# Altium project nuc972.PrjPcb
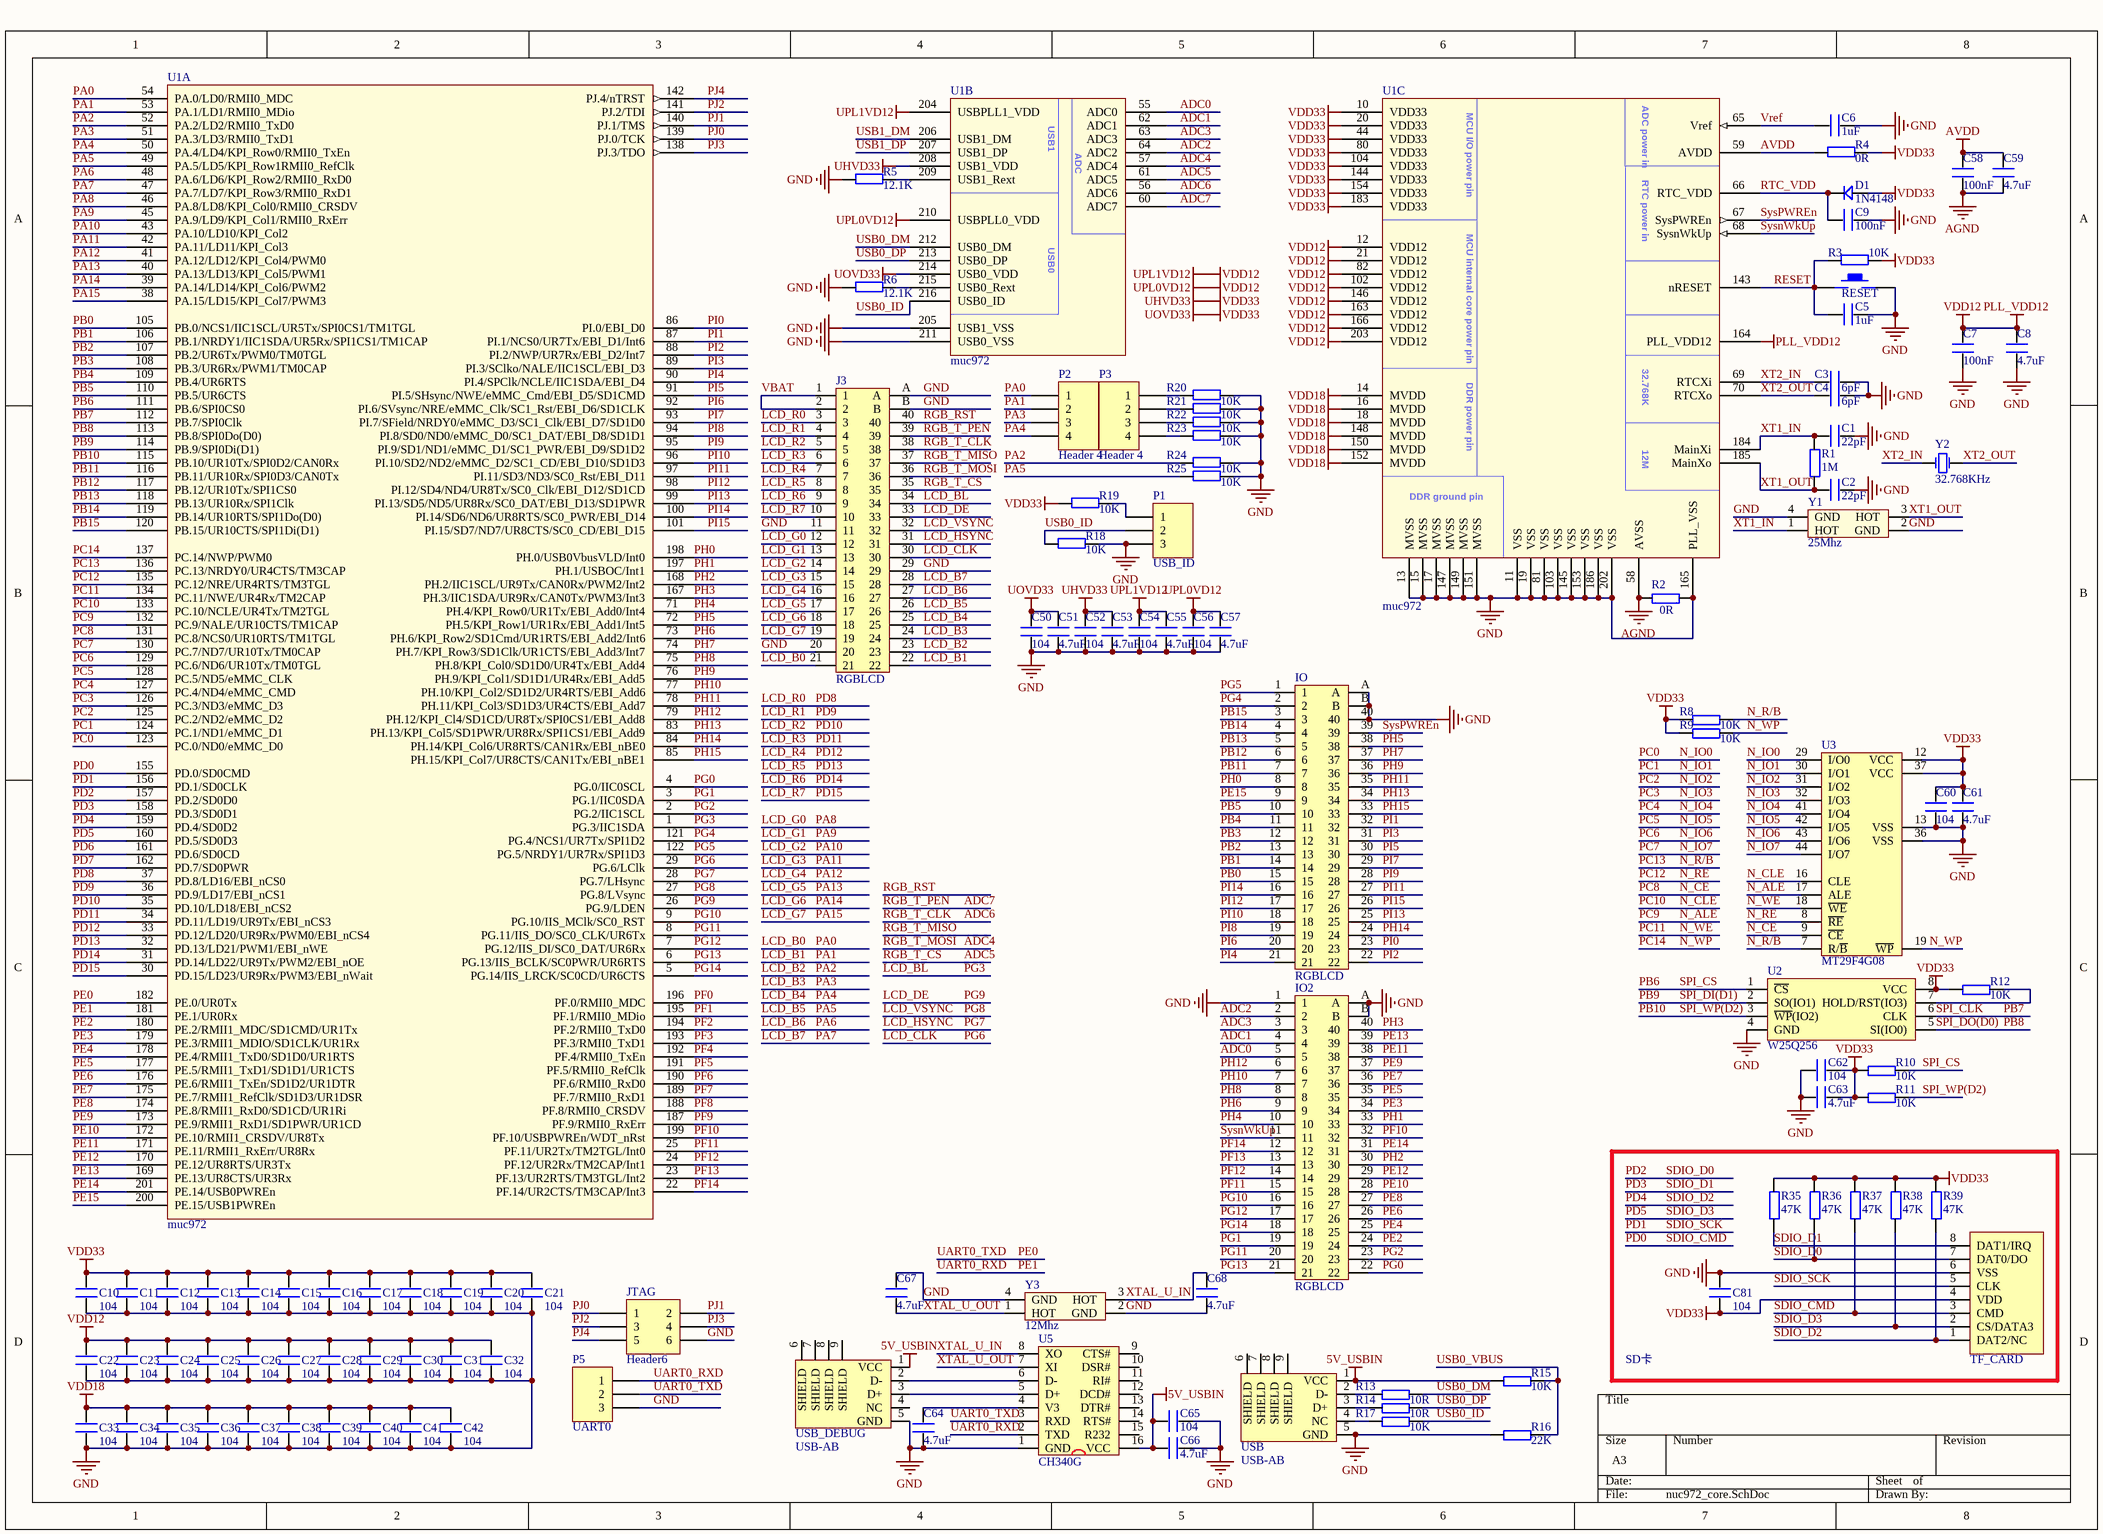
[diagram p0: nuc972_core.SchDoc]
2 sheets, 169 parts. Net scope: global (net labels, ports and power ports of the same name join across sheets).
Board file: nuc972.PcbDoc
Sheets:
  nuc972_core.SchDoc
  nuc972_power.SchDoc

## Sheet nuc972_core.SchDoc
size A3

### Parts
C1  22pF  [C 0603_L]
C2  22pF  [C 0603_L]
C3  6pF  [C 0603_L]
C4  6pF  [C 0603_L]
C5  1uF  [C 0603_L]
C6  1uF  [C 0603_L]
C7  100nF  [C 0603_L]
C8  4.7uF  [C 0603_L]
C9  100nF  [C 0603_L]
C10  104  [C 0603_L]
C11  104  [C 0603_L]
C12  104  [C 0603_L]
C13  104  [C 0603_L]
C14  104  [C 0603_L]
C15  104  [C 0603_L]
C16  104  [C 0603_L]
C17  104  [C 0603_L]
C18  104  [C 0603_L]
C19  104  [C 0603_L]
C20  104  [C 0603_L]
C21  104  [C 0603_L]
C22  104  [C 0603_L]
C23  104  [C 0603_L]
C24  104  [C 0603_L]
C25  104  [C 0603_L]
C26  104  [C 0603_L]
C27  104  [C 0603_L]
C28  104  [C 0603_L]
C29  104  [C 0603_L]
C30  104  [C 0603_L]
C31  104  [C 0603_L]
C32  104  [C 0603_L]
C33  104  [C 0603_L]
C34  104  [C 0603_L]
C35  104  [C 0603_L]
C36  104  [C 0603_L]
C37  104  [C 0603_L]
C38  104  [C 0603_L]
C39  104  [C 0603_L]
C40  104  [C 0603_L]
C41  104  [C 0603_L]
C42  104  [C 0603_L]
C50  104  [C 0603_L]
C51  4.7uF  [C 0603_L]
C52  104  [C 0603_L]
C53  4.7uF  [C 0603_L]
C54  104  [C 0603_L]
C55  4.7uF  [C 0603_L]
C56  104  [C 0603_L]
C57  4.7uF  [C 0603_L]
C58  100nF  [C 0603_L]
C59  4.7uF  [C 0603_L]
C60  104  [C 0603_L]
C61  4.7uF  [C 0603_L]
C62  104  [C 0603_L]
C63  4.7uF  [C 0603_L]
C64  4.7uF  [C 0603_L]
C65  104  [C 0603_L]
C66  4.7uF  [C 0603_L]
C67  4.7uF  [C 0603_L]
C68  4.7uF  [C 0603_L]
C81  104  [C 0603_L]
D1  1N4148  [MINI_MELF (LL34)]
IO  RGBLCD  [FPC-TOP40]
IO2  RGBLCD  [FPC-TOP40]
J3  RGBLCD  [FPC-TOP40]
JTAG  Header6  [HDR2.54-LI-6P]
P1  USB_ID  [HDR2.54-LI-3P]
P2  Header 4  [HDR2.54-LI-4P]
P3  Header 4  [HDR2.54-LI-4P]
P5  UART0  [HDR2.54-LI-3P]
R1  1M  [R 0603_L]
R2  0R  [R 0603_L]
R3  10K  [R 0603_L]
R4  0R  [R 0603_L]
R5  12.1K  [R 0603_L]
R6  12.1K  [R 0603_L]
R8  10K  [R 0603_L]
R9  10K  [R 0603_L]
R10  10K  [R 0603_L]
R11  10K  [R 0603_L]
R12  10K  [R 0603_L]
R13  10R  [R 0603_L]
R14  10R  [R 0603_L]
R15  10K  [R 0603_L]
R16  22K  [R 0603_L]
R17  10K  [R 0603_L]
R18  10K  [R 0603_L]
R19  10K  [R 0603_L]
R20  10K  [R 0603_L]
R21  10K  [R 0603_L]
R22  10K  [R 0603_L]
R23  10K  [R 0603_L]
R24  10K  [R 0603_L]
R25  10K  [R 0603_L]
R35  47K  [R 0603_L]
R36  47K  [R 0603_L]
R37  47K  [R 0603_L]
R38  47K  [R 0603_L]
R39  47K  [R 0603_L]
RESET  KEY_M  [TSW DIP-6*6*5]  (value not drawn)
TF_CARD  SD-MICRO-TF  [SD-MICRO-TF]  (value not drawn)
U1  muc972  [LQFP_216]  (parts A,B,C of 3)
U2  W25Q256  [SOP8W_N]
U3  MT29F4G08  [TSOP48]
U5  CH340G  [SOP16_N]
USB  USB-AB  [USB-MICRO_B]
USB_DEBUG  USB-AB  [USB-MICRO_B]
Y1  25Mhz  [OSC 3225-4P]
Y2  32.768KHz  [OSC 3215-2P]
Y3  12Mhz  [OSC 3225-4P]

### Blocks framed on the sheet
SD卡: C81 R35-R39 TF_CARD

### Nets
5V_USBIN: C65.1 C66.1 R15.1 U5.16(VCC) USB.1(VCC) USB_DEBUG.1(VCC)
AGND: C58.1 C59.1 R2.1 U1.58(AVSS)
AVDD: C58.2 C59.2 R4.2 U1.59(AVDD)
GND: C1.1 C2.1 C3.1 C4.1 C5.2 C6.2 C7.1 C8.1 C9.1 C10.1 C11.1 C12.1 C13.1 C14.1 C15.1 C16.1 C17.1 C18.1 C19.1 C20.1 C21.1 C22.1 C23.1 C24.1 C25.1 C26.1 C27.1 C28.1 C29.1 C30.1 C31.1 C32.1 C33.1 C34.1 C35.1 C36.1 C37.1 C38.1 C39.1 C40.1 C41.1 C42.1 C50.1 C51.1 C52.1 C53.1 C54.1 C55.1 C56.1 C57.1 C60.1 C61.1 C62.2 C63.2 C64.2 C65.2 C66.2 C67.2 C68.1 C81.2 IO.40 IO.A IO.B IO2.1 IO2.A IO2.B J3.11 J3.20 J3.29 J3.A J3.B JTAG.6 P1.3 P5.3 R2.2 R5.2 R6.2 R16.1 R18.1 R20.1 R21.1 R22.1 R23.1 R24.1 R25.1 RESET.2 TF_CARD.6(VSS) U1.11(VSS) U1.13(MVSS) U1.15(MVSS) U1.17(MVSS) U1.19(VSS) U1.81(VSS) U1.103(VSS) U1.145(VSS) U1.147(MVSS) U1.149(MVSS) U1.151(MVSS) U1.153(VSS) U1.165(PLL_VSS) U1.186(VSS) U1.202(VSS) U1.205(USB1_VSS) U1.211(USB0_VSS) U2.4(GND) U3.13(VSS) U3.36(VSS) U5.1(GND) USB.5(GND) USB_DEBUG.5(GND) Y1.2(GND) Y1.4(GND) Y3.2(GND) Y3.4(GND)
PLL_VDD12: C7.2 C8.2 C22.2 C23.2 C24.2 C25.2 C26.2 C27.2 C28.2 C29.2 C30.2 C31.2 C32.2 C54.2 C55.2 C56.2 C57.2 U1.12(VDD12) U1.21(VDD12) U1.82(VDD12) U1.102(VDD12) U1.146(VDD12) U1.163(VDD12) U1.164(PLL_VDD12) U1.166(VDD12) U1.203(VDD12) U1.204(USBPLL1_VDD) U1.210(USBPLL0_VDD)  [also labelled UPL0VD12, UPL1VD12, VDD12]
UHVD33: C10.2 C11.2 C12.2 C13.2 C14.2 C15.2 C16.2 C17.2 C18.2 C19.2 C20.2 C21.2 C50.2 C51.2 C52.2 C53.2 C60.2 C61.2 C62.1 C63.1 C81.1 D1.1 R3.1 R4.1 R8.1 R9.1 R10.1 R11.1 R12.1 R19.2 R35.2 R36.2 R37.2 R38.2 R39.2 TF_CARD.4(VDD) U1.10(VDD33) U1.20(VDD33) U1.44(VDD33) U1.80(VDD33) U1.104(VDD33) U1.144(VDD33) U1.154(VDD33) U1.183(VDD33) U1.208(USB1_VDD) U1.214(USB0_VDD) U2.8(VCC) U3.12(VCC) U3.37(VCC)  [also labelled UOVD33, VDD33]
VBAT: J3.1 J3.2
VDD18: C33.2 C34.2 C35.2 C36.2 C37.2 C38.2 C39.2 C40.2 C41.2 C42.2 U1.14(MVDD) U1.16(MVDD) U1.18(MVDD) U1.148(MVDD) U1.150(MVDD) U1.152(MVDD)
ADC0: IO2.5 U1.55(ADC0)
ADC1: IO2.4 U1.62(ADC1)
ADC2: IO2.2 U1.64(ADC2)
ADC3: IO2.3 U1.63(ADC3)
ADC4: J3.36 U1.57(ADC4)  [also labelled RGB_T_MOSI]
ADC5: J3.35 U1.61(ADC5)  [also labelled RGB_T_CS]
ADC6: J3.38 U1.56(ADC6)  [also labelled RGB_T_CLK]
ADC7: J3.39 U1.60(ADC7)  [also labelled RGB_T_PEN]
LCD_B0: J3.21 P2.1 U1.54(PA.0/LD0/RMII0_MDC)  [also labelled PA0]
LCD_B1: J3.22 P2.2 U1.53(PA.1/LD1/RMII0_MDio)  [also labelled PA1]
LCD_B2: J3.23 R24.2 U1.52(PA.2/LD2/RMII0_TxD0)  [also labelled PA2]
LCD_B3: J3.24 P2.3 U1.51(PA.3/LD3/RMII0_TxD1)  [also labelled PA3]
LCD_B4: J3.25 P2.4 U1.50(PA.4/LD4/KPI_Row0/RMII0_TxEn)  [also labelled PA4]
LCD_B5: J3.26 R25.2 U1.49(PA.5/LD5/KPI_Row1RMII0_RefClk)  [also labelled PA5]
LCD_B6: J3.27 U1.48(PA.6/LD6/KPI_Row2/RMII0_RxD0)  [also labelled PA6]
LCD_B7: J3.28 U1.47(PA.7/LD7/KPI_Row3/RMII0_RxD1)  [also labelled PA7]
LCD_BL: J3.34 U1.1(PG.3/IIC1SDA)  [also labelled PG3]
LCD_CLK: J3.30 U1.29(PG.6/LClk)  [also labelled PG6]
LCD_DE: J3.33 U1.26(PG.9/LDEN)  [also labelled PG9]
LCD_G0: J3.12 U1.46(PA.8/LD8/KPI_Col0/RMII0_CRSDV)  [also labelled PA8]
LCD_G1: J3.13 U1.45(PA.9/LD9/KPI_Col1/RMII0_RxErr)  [also labelled PA9]
LCD_G2: J3.14 U1.43(PA.10/LD10/KPI_Col2)  [also labelled PA10]
LCD_G3: J3.15 U1.42(PA.11/LD11/KPI_Col3)  [also labelled PA11]
LCD_G4: J3.16 U1.41(PA.12/LD12/KPI_Col4/PWM0)  [also labelled PA12]
LCD_G5: J3.17 U1.40(PA.13/LD13/KPI_Col5/PWM1)  [also labelled PA13]
LCD_G6: J3.18 U1.39(PA.14/LD14/KPI_Col6/PWM2)  [also labelled PA14]
LCD_G7: J3.19 U1.38(PA.15/LD15/KPI_Col7/PWM3)  [also labelled PA15]
LCD_HSYNC: J3.31 U1.28(PG.7/LHsync)  [also labelled PG7]
LCD_R0: J3.3 U1.37(PD.8/LD16/EBI_nCS0)  [also labelled PD8]
LCD_R1: J3.4 U1.36(PD.9/LD17/EBI_nCS1)  [also labelled PD9]
LCD_R2: J3.5 U1.35(PD.10/LD18/EBI_nCS2)  [also labelled PD10]
LCD_R3: J3.6 U1.34(PD.11/LD19/UR9Tx/EBI_nCS3)  [also labelled PD11]
LCD_R4: J3.7 U1.33(PD.12/LD20/UR9Rx/PWM0/EBI_nCS4)  [also labelled PD12]
LCD_R5: J3.8 U1.32(PD.13/LD21/PWM1/EBI_nWE)  [also labelled PD13]
LCD_R6: J3.9 U1.31(PD.14/LD22/UR9Tx/PWM2/EBI_nOE)  [also labelled PD14]
LCD_R7: J3.10 U1.30(PD.15/LD23/UR9Rx/PWM3/EBI_nWait)  [also labelled PD15]
LCD_VSYNC: J3.32 U1.27(PG.8/LVsync)  [also labelled PG8]
N_ALE: U1.132(PC.9/NALE/UR10CTS/TM1CAP) U3.17(ALE)  [also labelled PC9]
N_CE: U1.131(PC.8/NCS0/UR10RTS/TM1TGL) U3.9(~{CE})  [also labelled PC8]
N_CLE: U1.133(PC.10/NCLE/UR4Tx/TM2TGL) U3.16(CLE)  [also labelled PC10]
N_IO0: U1.123(PC.0/ND0/eMMC_D0) U3.29(I/O0)  [also labelled PC0]
N_IO1: U1.124(PC.1/ND1/eMMC_D1) U3.30(I/O1)  [also labelled PC1]
N_IO2: U1.125(PC.2/ND2/eMMC_D2) U3.31(I/O2)  [also labelled PC2]
N_IO3: U1.126(PC.3/ND3/eMMC_D3) U3.32(I/O3)  [also labelled PC3]
N_IO4: U1.127(PC.4/ND4/eMMC_CMD) U3.41(I/O4)  [also labelled PC4]
N_IO5: U1.128(PC.5/ND5/eMMC_CLK) U3.42(I/O5)  [also labelled PC5]
N_IO6: U1.129(PC.6/ND6/UR10Tx/TM0TGL) U3.43(I/O6)  [also labelled PC6]
N_IO7: U1.130(PC.7/ND7/UR10Tx/TM0CAP) U3.44(I/O7)  [also labelled PC7]
N_R/B: R8.2 U1.136(PC.13/NRDY0/UR4CTS/TM3CAP) U3.7(R/~{B})  [also labelled PC13]
N_RE: U1.135(PC.12/NRE/UR4RTS/TM3TGL) U3.8(~{RE})  [also labelled PC12]
N_WE: U1.134(PC.11/NWE/UR4Rx/TM2CAP) U3.18(~{WE})  [also labelled PC11]
N_WP: R9.2 U1.137(PC.14/NWP/PWM0) U3.19(~{WP})  [also labelled PC14]
PB0: IO.15 U1.105(PB.0/NCS1/IIC1SCL/UR5Tx/SPI0CS1/TM1TGL)
PB1: IO.14 U1.106(PB.1/NRDY1/IIC1SDA/UR5Rx/SPI1CS1/TM1CAP)
PB2: IO.13 U1.107(PB.2/UR6Tx/PWM0/TM0TGL)
PB3: IO.12 U1.108(PB.3/UR6Rx/PWM1/TM0CAP)
PB4: IO.11 U1.109(PB.4/UR6RTS)
PB5: IO.10 U1.110(PB.5/UR6CTS)
PB6: R10.2 U1.111(PB.6/SPI0CS0) U2.1(~{CS})  [also labelled SPI_CS]
PB7: U1.112(PB.7/SPI0Clk) U2.6(CLK)  [also labelled SPI_CLK]
PB8: U1.113(PB.8/SPI0Do(D0)) U2.5(SI(IO0))  [also labelled SPI_DO(D0)]
PB9: U1.114(PB.9/SPI0Di(D1)) U2.2(SO(IO1))  [also labelled SPI_DI(D1)]
PB10: R11.2 U1.115(PB.10/UR10Tx/SPI0D2/CAN0Rx) U2.3(~{WP}(IO2))  [also labelled SPI_WP(D2)]
PB11: IO.7 U1.116(PB.11/UR10Rx/SPI0D3/CAN0Tx)
PB12: IO.6 U1.117(PB.12/UR10Tx/SPI1CS0)
PB13: IO.5 U1.118(PB.13/UR10Rx/SPI1Clk)
PB14: IO.4 U1.119(PB.14/UR10RTS/SPI1Do(D0))
PB15: IO.3 U1.120(PB.15/UR10CTS/SPI1Di(D1))
PD0: R37.1 TF_CARD.3(CMD) U1.155(PD.0/SD0CMD)  [also labelled SDIO_CMD]
PD1: TF_CARD.5(CLK) U1.156(PD.1/SD0CLK)  [also labelled SDIO_SCK]
PD2: R36.1 TF_CARD.7(DAT0/DO) U1.157(PD.2/SD0D0)  [also labelled SDIO_D0]
PD3: R35.1 TF_CARD.8(DAT1/IRQ) U1.158(PD.3/SD0D1)  [also labelled SDIO_D1]
PD4: R39.1 TF_CARD.1(DAT2/NC) U1.159(PD.4/SD0D2)  [also labelled SDIO_D2]
PD5: R38.1 TF_CARD.2(CS/DATA3) U1.160(PD.5/SD0D3)  [also labelled SDIO_D3]
PD6: U1.161(PD.6/SD0CD)
PD7: U1.162(PD.7/SD0PWR)
PE0: P5.2 U1.182(PE.0/UR0Tx) U5.3(RXD)  [also labelled UART0_TXD]
PE1: P5.1 U1.181(PE.1/UR0Rx) U5.2(TXD)  [also labelled UART0_RXD]
PE2: IO2.24 U1.180(PE.2/RMII1_MDC/SD1CMD/UR1Tx)
PE3: IO2.34 U1.179(PE.3/RMII1_MDIO/SD1CLK/UR1Rx)
PE4: IO2.25 U1.178(PE.4/RMII1_TxD0/SD1D0/UR1RTS)
PE5: IO2.35 U1.177(PE.5/RMII1_TxD1/SD1D1/UR1CTS)
PE6: IO2.26 U1.176(PE.6/RMII1_TxEn/SD1D2/UR1DTR)
PE7: IO2.36 U1.175(PE.7/RMII1_RefClk/SD1D3/UR1DSR)
PE8: IO2.27 U1.174(PE.8/RMII1_RxD0/SD1CD/UR1Ri)
PE9: IO2.37 U1.173(PE.9/RMII1_RxD1/SD1PWR/UR1CD)
PE10: IO2.28 U1.172(PE.10/RMII1_CRSDV/UR8Tx)
PE11: IO2.38 U1.171(PE.11/RMII1_RxErr/UR8Rx)
PE12: IO2.29 U1.170(PE.12/UR8RTS/UR3Tx)
PE13: IO2.39 U1.169(PE.13/UR8CTS/UR3Rx)
PE14: IO2.31 U1.201(PE.14/USB0PWREn)
PE15: IO.9 U1.200(PE.15/USB1PWREn)
PF0: U1.196(PF.0/RMII0_MDC)  [project net ETH_MDC]
PF1: U1.195(PF.1/RMII0_MDio)  [project net ETH_MDIO]
PF2: U1.194(PF.2/RMII0_TxD0)
PF3: U1.193(PF.3/RMII0_TxD1)
PF4: U1.192(PF.4/RMII0_TxEn)
PF5: U1.191(PF.5/RMII0_RefClk)
PF6: U1.190(PF.6/RMII0_RxD0)
PF7: U1.189(PF.7/RMII0_RxD1)
PF8: U1.188(PF.8/RMII0_CRSDV)
PF9: U1.187(PF.9/RMII0_RxErr)
PF10: IO2.32 U1.199(PF.10/USBPWREn/WDT_nRst)
PF11: IO2.15 U1.25(PF.11/UR2Tx/TM2TGL/Int0)
PF12: IO2.14 U1.24(PF.12/UR2Rx/TM2CAP/Int1)
PF13: IO2.13 U1.23(PF.13/UR2RTS/TM3TGL/Int2)
PF14: IO2.12 U1.22(PF.14/UR2CTS/TM3CAP/Int3)
PG0: IO2.22 U1.4(PG.0/IIC0SCL)
PG1: IO2.19 U1.3(PG.1/IIC0SDA)
PG2: IO2.23 U1.2(PG.2/IIC1SCL)
PG4: IO.2 U1.121(PG.4/NCS1/UR7Tx/SPI1D2)
PG5: IO.1 U1.122(PG.5/NRDY1/UR7Rx/SPI1D3)
PG10: IO2.16 U1.9(PG.10/IIS_MClk/SC0_RST)
PG11: IO2.20 U1.8(PG.11/IIS_DO/SC0_CLK/UR6Tx)
PG12: IO2.17 U1.7(PG.12/IIS_DI/SC0_DAT/UR6Rx)
PG13: IO2.21 U1.6(PG.13/IIS_BCLK/SC0PWR/UR6RTS)
PG14: IO2.18 U1.5(PG.14/IIS_LRCK/SC0CD/UR6CTS)
PH0: IO.8 U1.198(PH.0/USB0VbusVLD/Int0)
PH1: IO2.33 U1.197(PH.1/USBOC/Int1)
PH2: IO2.30 U1.168(PH.2/IIC1SCL/UR9Tx/CAN0Rx/PWM2/Int2)
PH3: IO2.40 U1.167(PH.3/IIC1SDA/UR9Rx/CAN0Tx/PWM3/Int3)
PH4: IO2.10 U1.71(PH.4/KPI_Row0/UR1Tx/EBI_Add0/Int4)
PH5: IO.38 U1.72(PH.5/KPI_Row1/UR1Rx/EBI_Add1/Int5)
PH6: IO2.9 U1.73(PH.6/KPI_Row2/SD1Cmd/UR1RTS/EBI_Add2/Int6)
PH7: IO.37 U1.74(PH.7/KPI_Row3/SD1Clk/UR1CTS/EBI_Add3/Int7)
PH8: IO2.8 U1.75(PH.8/KPI_Col0/SD1D0/UR4Tx/EBI_Add4)
PH9: IO.36 U1.76(PH.9/KPI_Col1/SD1D1/UR4Rx/EBI_Add5)
PH10: IO2.7 U1.77(PH.10/KPI_Col2/SD1D2/UR4RTS/EBI_Add6)
PH11: IO.35 U1.78(PH.11/KPI_Col3/SD1D3/UR4CTS/EBI_Add7)
PH12: IO2.6 U1.79(PH.12/KPI_Cl4/SD1CD/UR8Tx/SPI0CS1/EBI_Add8)
PH13: IO.34 U1.83(PH.13/KPI_Col5/SD1PWR/UR8Rx/SPI1CS1/EBI_Add9)
PH14: IO.24 U1.84(PH.14/KPI_Col6/UR8RTS/CAN1Rx/EBI_nBE0)
PH15: IO.33 U1.85(PH.15/KPI_Col7/UR8CTS/CAN1Tx/EBI_nBE1)
PI0: IO.23 U1.86(PI.0/EBI_D0)
PI1: IO.32 U1.87(PI.1/NCS0/UR7Tx/EBI_D1/Int6)
PI2: IO.22 U1.88(PI.2/NWP/UR7Rx/EBI_D2/Int7)
PI3: IO.31 U1.89(PI.3/SClko/NALE/IIC1SCL/EBI_D3)
PI4: IO.21 U1.90(PI.4/SPClk/NCLE/IIC1SDA/EBI_D4)
PI5: IO.30 U1.91(PI.5/SHsync/NWE/eMMC_Cmd/EBI_D5/SD1CMD)
PI6: IO.20 U1.92(PI.6/SVsync/NRE/eMMC_Clk/SC1_Rst/EBI_D6/SD1CLK)
PI7: IO.29 U1.93(PI.7/SField/NRDY0/eMMC_D3/SC1_Clk/EBI_D7/SD1D0)
PI8: IO.19 U1.94(PI.8/SD0/ND0/eMMC_D0/SC1_DAT/EBI_D8/SD1D1)
PI9: IO.28 U1.95(PI.9/SD1/ND1/eMMC_D1/SC1_PWR/EBI_D9/SD1D2)
PI10: IO.18 U1.96(PI.10/SD2/ND2/eMMC_D2/SC1_CD/EBI_D10/SD1D3)
PI11: IO.27 U1.97(PI.11/SD3/ND3/SC0_Rst/EBI_D11)
PI12: IO.17 U1.98(PI.12/SD4/ND4/UR8Tx/SC0_Clk/EBI_D12/SD1CD)
PI13: IO.25 U1.99(PI.13/SD5/ND5/UR8Rx/SC0_DAT/EBI_D13/SD1PWR)
PI14: IO.16 U1.100(PI.14/SD6/ND6/UR8RTS/SC0_PWR/EBI_D14)
PI15: IO.26 U1.101(PI.15/SD7/ND7/UR8CTS/SC0_CD/EBI_D15)
PJ0: JTAG.1 U1.139(PJ.0/TCK)
PJ1: JTAG.2 U1.140(PJ.1/TMS)
PJ2: JTAG.3 U1.141(PJ.2/TDI)
PJ3: JTAG.4 U1.138(PJ.3/TDO)
PJ4: JTAG.5 U1.142(PJ.4/nTRST)
RESET: C5.1 R3.2 RESET.1 U1.143(nRESET)
RGB_RST: J3.40
RGB_T_MISO: J3.37
RTC_VDD: C9.2 D1.2 U1.66(RTC_VDD)
SysnWkUp: IO2.11 U1.68(SysnWkUp)
SysPWREn: IO.39 U1.67(SysPWREn)
USB0_DM: R13.2 U1.212(USB0_DM)
USB0_DP: R14.2 U1.213(USB0_DP)
USB0_ID: P1.2 R17.2 R18.2 U1.216(USB0_ID)
USB0_VBUS: R15.2 R16.2
USB1_DM: U1.206(USB1_DM)
USB1_DP: U1.207(USB1_DP)
Vref: C6.1 U1.65(Vref)
XT1_IN: C1.2 R1.2 U1.184(MainXi) Y1.1(HOT)
XT1_OUT: C2.2 R1.1 U1.185(MainXo) Y1.3(HOT)
XT2_IN: C3.2 U1.69(RTCXi) Y2.1(OSC1)
XT2_OUT: C4.2 U1.70(RTCXo) Y2.2(OSC2)
XTAL_U_IN: C68.2 U5.8(XO) Y3.3(HOT)
XTAL_U_OUT: C67.1 U5.7(XI) Y3.1(HOT)
NetC64_1: C64.1 U5.4(V3)
NetP1_1: P1.1 R19.1
NetP3_1: P3.1 R20.2
NetP3_2: P3.2 R21.2
NetP3_3: P3.3 R22.2
NetP3_4: P3.4 R23.2
NetR5_1: R5.1 U1.209(USB1_Rext)
NetR6_1: R6.1 U1.215(USB0_Rext)
NetR12_2: R12.2 U2.7(HOLD/RST(IO3))
NetR13_1: R13.1 USB.2(D-)
NetR14_1: R14.1 USB.3(D+)
NetR17_1: R17.1 USB.4(NC)
NetU5_5: U5.5(D+) USB_DEBUG.3(D+)
NetU5_6: U5.6(D-) USB_DEBUG.2(D-)

Not connected (* = marked no-connect by the designer): U5 9(CTS#) 10(DSR#) 11(RI#) 12(DCD#) 13(DTR#) 14(RTS#) 15(R232); USB 6(SHIELD) 7(SHIELD) 8(SHIELD) 9(SHIELD); USB_DEBUG 4(NC) 6(SHIELD) 7(SHIELD) 8(SHIELD) 9(SHIELD)

### Notes on the sheet
- (in symbol LQFP_216, part B) USB1; ADC; USB0
- (in symbol LQFP_216, part C) ADC power in; MCU I/O power pin; RTC power in; MCU internal core power pin; 32.768K; DDR power pin; 12M; DDR ground pin

### Library data of the parts
C1-C42 C50-C68 C81 = C
D1 = D
IO IO2 J3 = FPC-40: FPC-40P-0.5mm
JTAG = Header 3X2: Header, 3-Pin, Dual row; LatestRevisionDate: 17-Jul-2002; LatestRevisionNote: Re-released for DXP Platform.; Publisher: Altium Limited
P1 P5 = Header 3: Header, 3-Pin; LatestRevisionDate: 17-Jul-2002; LatestRevisionNote: Re-released for DXP Platform.; Publisher: Altium Limited
P2 P3 = Header 4: Header, 4-Pin; LatestRevisionDate: 17-Jul-2002; LatestRevisionNote: Re-released for DXP Platform.; Publisher: Altium Limited
R1-R6 R8-R25 R35-R39 = R
TF_CARD = SD-MICRO-TF: SD,MICRO,TF
U1 = LQFP_216
U2 = W25Q128
U3 = K9F2G08U0C: 256MB NAND FLASH
U5 = CH340G: USB2UART
USB USB_DEBUG = USB-AB: MicroUSB
Y1 Y3 = XTAL_3225: 3225贴片无源晶振
Y2 = XTAL: 普通晶振; Published: 8-Jun-2000; LatestRevisionDate: 17-Jul-2002; LatestRevisionNote: Re-released for DXP Platform.; Publisher: Altium Limited

## Sheet nuc972_power.SchDoc
size A4
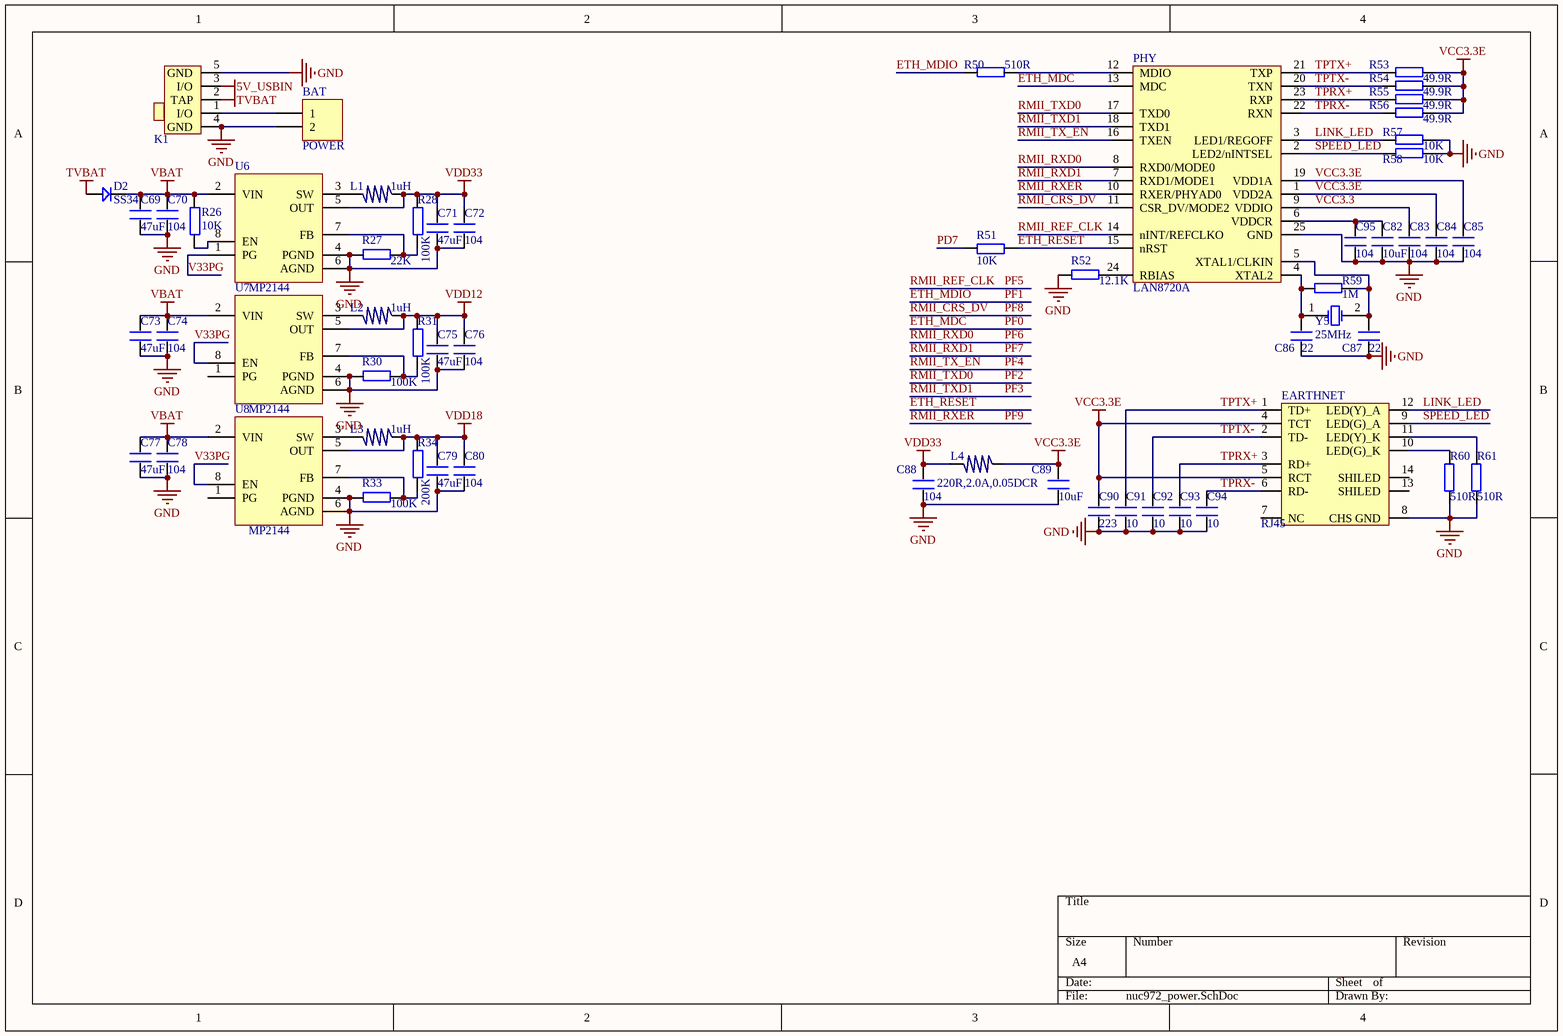
[diagram p1: nuc972_power.SchDoc]

### Parts
BAT  POWER  [HDR1X2]
C69  47uF  [C 0805_L]
C70  104  [C 0603_L]
C71  47uF  [C 0805_L]
C72  104  [C 0603_L]
C73  47uF  [C 0805_L]
C74  104  [C 0603_L]
C75  47uF  [C 0805_L]
C76  104  [C 0603_L]
C77  47uF  [C 0805_L]
C78  104  [C 0603_L]
C79  47uF  [C 0805_L]
C80  104  [C 0603_L]
C82  10uF  [C 0603_L]
C83  104  [C 0603_L]
C84  104  [C 0603_L]
C85  104  [C 0603_L]
C86  22  [C 0603_L]
C87  22  [C 0603_L]
C88  104  [C 0603_L]
C89  10uF  [C 0603_L]
C90  223  [C 0603_L]
C91  10  [C 0603_L]
C92  10  [C 0603_L]
C93  10  [C 0603_L]
C94  10  [C 0603_L]
C95  104  [C 0603_L]
D2  SS34  [SMA]
EARTHNET  RJ45  [RJ-45A12]
K1  BUTTON_DIP3  [BTN8.8*4.6]  (value not drawn)
L1  1uH  [NR3015]
L2  1uH  [NR3015]
L3  1uH  [NR3015]
L4  220R,2.0A,0.05DCR  [L 0603]
PHY  LAN8720A  [QFN24 4x4_N]
R26  10K  [R 0603_L]
R27  22K  [R 0603_L]
R28  100K  [R 0603_L]
R30  100K  [R 0603_L]
R31  100K  [R 0603_L]
R33  100K  [R 0603_L]
R34  200K  [R 0603_L]
R50  510R  [R 0603_L]
R51  10K  [R 0603_L]
R52  12.1K  [R 0603_L]
R53  49.9R  [R 0603_L]
R54  49.9R  [R 0603_L]
R55  49.9R  [R 0603_L]
R56  49.9R  [R 0603_L]
R57  10K  [R 0603_L]
R58  10K  [R 0603_L]
R59  1M  [R 0603_L]
R60  510R  [R 0603_L]
R61  510R  [R 0603_L]
U6  MP2144  [SOT23-8L]
U7  MP2144  [SOT23-8L]
U8  MP2144  [SOT23-8L]
Y5  25MHz  [OSC HC-49S]

### Nets
5V_USBIN: K1.3(I/O)
GND: BAT.2 C69.1 C70.1 C71.1 C72.1 C73.1 C74.1 C75.1 C76.1 C77.1 C78.1 C79.1 C80.1 C82.1 C83.2 C84.2 C85.2 C86.2 C87.2 C88.2 C89.2 C90.2 C91.2 C92.2 C93.2 C94.2 C95.2 EARTHNET.8(CHS_GND) K1.4(GND) K1.5(GND) PHY.25(GND) R27.2 R30.2 R33.2 R52.2 R57.1 R58.1 R60.2 R61.2 U6.4(PGND) U6.6(AGND) U7.4(PGND) U7.6(AGND) U8.4(PGND) U8.6(AGND)
TVBAT: D2.1 K1.2(TAP)
VBAT: C69.2 C70.2 C73.2 C74.2 C77.2 C78.2 D2.2 R26.2 U6.2(VIN) U7.2(VIN) U8.2(VIN)
VCC3.3E: C84.1 C85.1 C89.1 C90.1 EARTHNET.4(TCT) EARTHNET.5(RCT) L4.1 PHY.1(VDD2A) PHY.19(VDD1A) R53.1 R54.1 R55.1 R56.1
VDD12: C75.2 C76.2 L2.1 R31.2 U7.5(OUT)  [project net PLL_VDD12]
VDD18: C79.2 C80.2 L3.1 R34.2 U8.5(OUT)
VDD33: C71.2 C72.2 C88.1 L1.1 L4.2 R28.2 U6.5(OUT)  [project net UHVD33]
ETH_MDC: PHY.13(MDC)  [also labelled PF0]
ETH_MDIO: R50.2  [also labelled PF1]
ETH_RESET: PHY.15(nRST) R51.2
LINK_LED: EARTHNET.12(LED(Y)_A) PHY.3(LED1/REGOFF) R57.2
PD7: R51.1
PF2: PHY.17(TXD0)  [also labelled RMII_TXD0]
PF3: PHY.18(TXD1)  [also labelled RMII_TXD1]
PF4: PHY.16(TXEN)  [also labelled RMII_TX_EN]
PF5: PHY.14(nINT/REFCLKO)  [also labelled RMII_REF_CLK]
PF6: PHY.8(RXD0/MODE0)  [also labelled RMII_RXD0]
PF7: PHY.7(RXD1/MODE1)  [also labelled RMII_RXD1]
PF8: PHY.11(CSR_DV/MODE2)  [also labelled RMII_CRS_DV]
PF9: PHY.10(RXER/PHYAD0)  [also labelled RMII_RXER]
SPEED_LED: EARTHNET.9(LED(G)_A) PHY.2(LED2/nINTSEL) R58.2
TPRX+: C93.1 EARTHNET.3(RD+) PHY.23(RXP) R55.2
TPRX-: C94.1 EARTHNET.6(RD-) PHY.22(RXN) R56.2
TPTX+: C91.1 EARTHNET.1(TD+) PHY.21(TXP) R53.2
TPTX-: C92.1 EARTHNET.2(TD-) PHY.20(TXN) R54.2
V33PG: U6.1(PG) U7.8(EN) U8.8(EN)
VCC3.3: C83.1 PHY.9(VDDIO)
NetBAT_1: BAT.1 K1.1(I/O)
NetC82_2: C82.2 C95.1 PHY.6(VDDCR)
NetC86_1: C86.1 PHY.4(XTAL2) R59.2 Y5.1(OSC1)
NetC87_1: C87.1 PHY.5(XTAL1/CLKIN) R59.1 Y5.2(OSC2)
NetEARTHNET_10: EARTHNET.10(LED(G)_K) R60.1
NetEARTHNET_11: EARTHNET.11(LED(Y)_K) R61.1
NetL1_2: L1.2 U6.3(SW)
NetL2_2: L2.2 U7.3(SW)
NetL3_2: L3.2 U8.3(SW)
NetPHY_12: PHY.12(MDIO) R50.1
NetPHY_24: PHY.24(RBIAS) R52.1
NetR26_1: R26.1 U6.8(EN)
NetR27_1: R27.1 R28.1 U6.7(FB)
NetR30_1: R30.1 R31.1 U7.7(FB)
NetR33_1: R33.1 R34.1 U8.7(FB)

Not connected (* = marked no-connect by the designer): EARTHNET 7(NC) 13(SHILED) 14(SHILED); U7 1(PG); U8 1(PG)

### Library data of the parts
BAT = Header 2: Header, 2-Pin; LatestRevisionDate: 17-Jul-2002; LatestRevisionNote: Re-released for DXP Platform.; Publisher: Altium Limited
C69-C80 C82-C95 = C
D2 = D
EARTHNET = HR911105
K1 = BUTTON_DIP3: 拨动开关SS-12F44
L1-L4 = L
PHY = LAN8720: ETH PHY
R26-R28 R30 R31 R33 R34 R50-R61 = R
Y5 = XTAL: Crystal Oscillator; Published: 8-Jun-2000; LatestRevisionDate: 17-Jul-2002; LatestRevisionNote: Re-released for DXP Platform.; Publisher: Altium Limited

## Nets that join several sheets
5V_USBIN: nuc972_core (6 pins), nuc972_power (K1.3)
GND: nuc972_core (114 pins), nuc972_power (45 pins)
PLL_VDD12: nuc972_core (28 pins), nuc972_power (5 pins)
UHVD33: nuc972_core (49 pins), nuc972_power (7 pins)
VBAT: nuc972_core (J3.1 J3.2), nuc972_power (11 pins)
VDD18: nuc972_core (16 pins), nuc972_power (5 pins)
ETH_MDC: nuc972_core (U1.196), nuc972_power (PHY.13)
ETH_MDIO: nuc972_core (U1.195), nuc972_power (R50.2)
PD7: nuc972_core (U1.162), nuc972_power (R51.1)
PF2: nuc972_core (U1.194), nuc972_power (PHY.17)
PF3: nuc972_core (U1.193), nuc972_power (PHY.18)
PF4: nuc972_core (U1.192), nuc972_power (PHY.16)
PF5: nuc972_core (U1.191), nuc972_power (PHY.14)
PF6: nuc972_core (U1.190), nuc972_power (PHY.8)
PF7: nuc972_core (U1.189), nuc972_power (PHY.7)
PF8: nuc972_core (U1.188), nuc972_power (PHY.11)
PF9: nuc972_core (U1.187), nuc972_power (PHY.10)